# Altium project 175-00017 rev 1, Two Axis Stepper Driver.PrjPCB
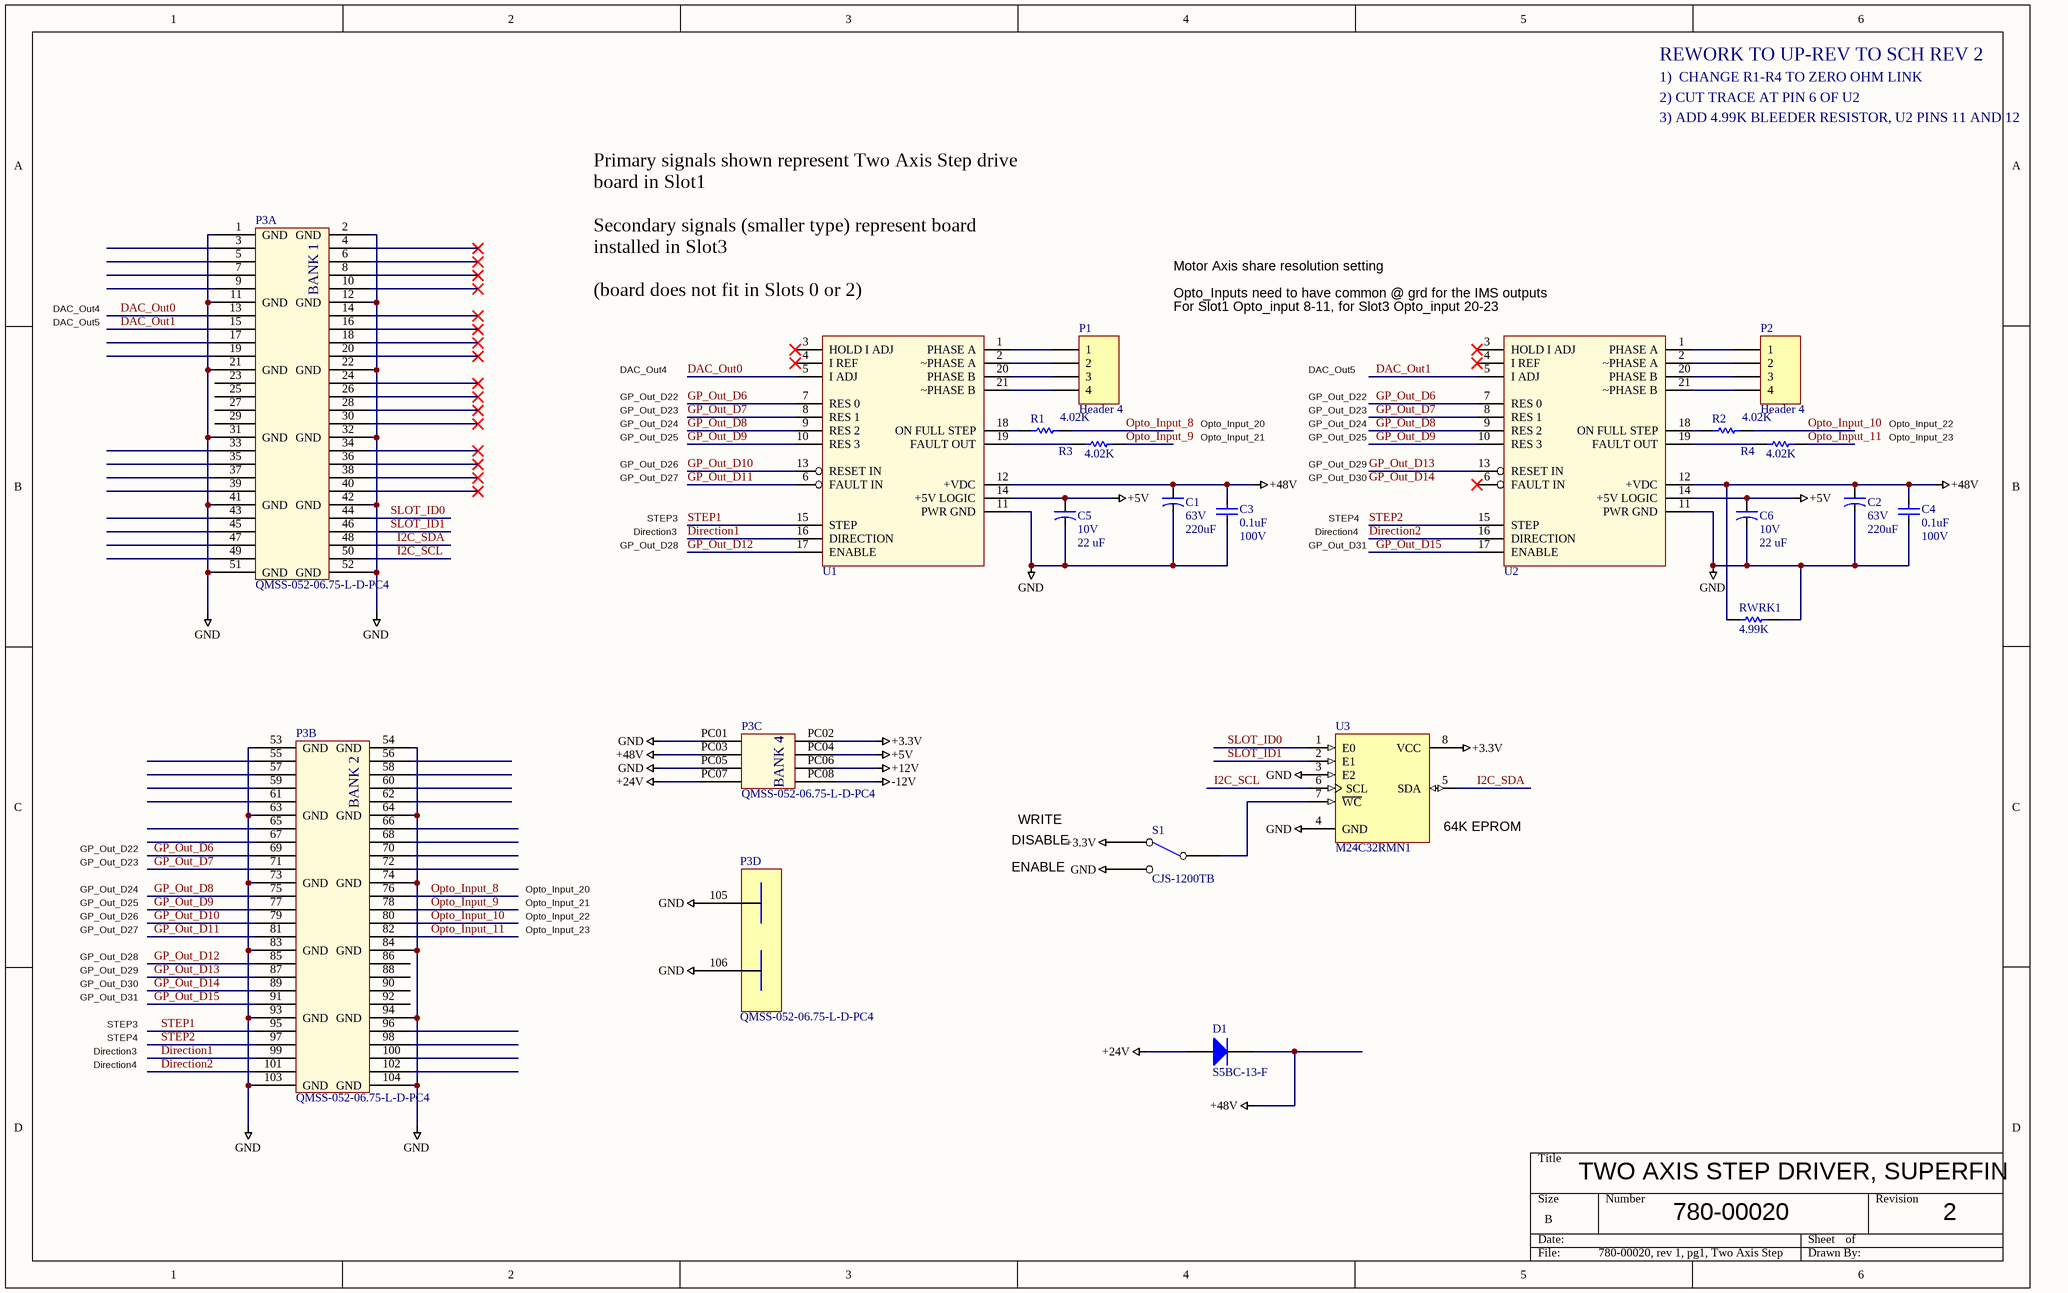
[diagram p0: 780-00020, rev 1, pg1, Two Axis Stepper Driver.SchDoc]
1 sheet, 19 parts. Net scope: global (net labels, ports and power ports of the same name join across sheets).
Board file: 175-00017_rev1, Two Axis Stepper Driver Apps Board.PcbDoc

## Sheet 780-00020, rev 1, pg1, Two Axis Stepper Driver.SchDoc
size B; PageSetup: Record=PageOptions|CenterHorizontal=True|CenterVertical=True|PrintScale=1.09|XCorrection=1.00|YCorrection=1.00|PrintKind=0|BorderSize=5000000|LeftOffset=0|BottomOffset=0|Orientation=2|PaperLength=1000|PaperWidth=1000|Scale=100|PaperSource=7|PrintQuality=-4|MediaType=1|DitherType=10|PaperKind=Tabloid 11 x 17in|PrintScaleMode=1

### Parts
C1  63V  value 220uF  [CAP 220uF 63V]
C2  63V  value 220uF  [CAP 220uF 63V]
C3  100V  value 0.1uF  [SMD_0805]
C4  100V  value 0.1uF  [SMD_0805]
C5  10V  value 22 uF  [SMD_CAP_3216]
C6  10V  value 22 uF  [SMD_CAP_3216]
D1  S5BC-13-F  [SMC]
P1  Header 4  [HDR1X4 for IDC]
P2  Header 4  [HDR1X4 for IDC]
P3  QMSS-052-06.75-L-D-PC4  [QMS SMD PWR PINS - 104PIN]  (parts A,B,C,D of 4)
R1  value 4.02K  [SMD_0805]  (hidden comment: Res 0805)
R2  value 4.02K  [SMD_0805]  (hidden comment: Res 0805)
R3  value 4.02K  [SMD_0805]  (hidden comment: Res 0805)
R4  value 4.02K  [SMD_0805]  (hidden comment: Res 0805)
RWRK1  value 4.99K  [AXIAL-0.4]  (hidden comment: Res TH)
S1  CJS-1200TB  [CAS-120B]
U1  IM481H Plus  [IM481H Vertical]  (value not drawn)
U2  IM481H Plus  [IM481H Vertical]  (value not drawn)
U3  M24C32RMN1  [SOP8_N]

### Nets
+3.3V: P3.PC02 S1.3(NC) U3.8(VCC)
+5V: C5.1 C6.1 P3.PC04 U1.14(+5V_LOGIC) U2.14(+5V_LOGIC)
+12V: P3.PC06
+24V: D1.1(A) P3.PC07
+48V: C1.1 C2.1 C3.2 C4.2 D1.2(K) P3.PC03 RWRK1.1 U1.12(+VDC) U2.12(+VDC)
-12V: P3.PC08
GND: C1.2 C2.2 C3.1 C4.1 C5.2 C6.2 P3.1(GND) P3.2(GND) P3.11(GND) P3.12(GND) P3.21(GND) P3.22(GND) P3.31(GND) P3.32(GND) P3.41(GND) P3.42(GND) P3.51(GND) P3.52(GND) P3.53(GND) P3.54(GND) P3.63(GND) P3.64(GND) P3.73(GND) P3.74(GND) P3.83(GND) P3.84(GND) P3.93(GND) P3.94(GND) P3.103(GND) P3.104(GND) P3.105(GND) P3.106(GND) P3.PC01 P3.PC05 RWRK1.2 S1.1(NO) U1.11(PWR_GND) U2.11(PWR_GND) U3.3(E2) U3.4(GND)
DAC_Out0: P3.13 U1.5(I_ADJ)
DAC_Out1: P3.15 U2.5(I_ADJ)
Direction1: P3.99 U1.16(DIRECTION)
Direction2: P3.101 U2.16(DIRECTION)
GP_Out_D6: P3.69 U1.7(RES_0) U2.7(RES_0)
GP_Out_D7: P3.71 U1.8(RES_1) U2.8(RES_1)
GP_Out_D8: P3.75 U1.9(RES_2) U2.9(RES_2)
GP_Out_D9: P3.77 U1.10(RES_3) U2.10(RES_3)
GP_Out_D10: P3.79 U1.13(RESET_IN)
GP_Out_D11: P3.81 U1.6(FAULT_IN)
GP_Out_D12: P3.85 U1.17(ENABLE)
GP_Out_D13: P3.87 U2.13(RESET_IN)
GP_Out_D14: P3.89
GP_Out_D15: P3.91 U2.17(ENABLE)
I2C_SCL: P3.50 U3.6(SCL)
I2C_SDA: P3.48 U3.5(SDA)
Opto_Input_8: P3.76 R1.2
Opto_Input_9: P3.78 R3.2
Opto_Input_10: P3.80 R2.2
Opto_Input_11: P3.82 R4.2
SLOT_ID0: P3.44 U3.1(E0)
SLOT_ID1: P3.46 U3.2(E1)
STEP1: P3.95 U1.15(STEP)
STEP2: P3.97 U2.15(STEP)
NetP1_1: P1.1 U1.1(PHASE_A)
NetP1_2: P1.2 U1.2(~PHASE_A)
NetP1_3: P1.3 U1.20(PHASE_B)
NetP1_4: P1.4 U1.21(~PHASE_B)
NetP2_1: P2.1 U2.1(PHASE_A)
NetP2_2: P2.2 U2.2(~PHASE_A)
NetP2_3: P2.3 U2.20(PHASE_B)
NetP2_4: P2.4 U2.21(~PHASE_B)
NetR1_1: R1.1 U1.18(ON_FULL_STEP)
NetR2_1: R2.1 U2.18(ON_FULL_STEP)
NetR3_1: R3.1 U1.19(FAULT_OUT)
NetR4_1: R4.1 U2.19(FAULT_OUT)
NetS1_2: S1.2(COM) U3.7(~{WC})

Not connected (* = marked no-connect by the designer): P3 3 4* 5 6* 7 8* 9 10* 14* 16* 17 18* 19 20* 23 24* 25 26* 27 28* 29 30* 33 34* 35 36* 37 38* 39 40* 43 45 47 49 55 56 57 58 59 60 61 62 65 66 67 68 70 72 86 88 90 92 96 98 100 102; U1 3(HOLD_I_ADJ)* 4(I_REF)*; U2 3(HOLD_I_ADJ)* 4(I_REF)* 6(FAULT_IN)*

### Notes on the sheet
- REWORK TO UP-REV TO SCH REV 2
- 1)  CHANGE R1-R4 TO ZERO OHM LINK
- 2) CUT TRACE AT PIN 6 OF U2
- 3) ADD 4.99K BLEEDER RESISTOR, U2 PINS 11 AND 12
- Motor Axis share resolution setting
- (near U2) Opto_Inputs need to have common @ grd for the IMS outputs
- DAC_Out4
- DAC_Out5
- Primary signals shown represent Two Axis Step drive board in Slot1
  Secondary signals (smaller type) represent board installed in Slot3
  (board does not fit in Slots 0 or 2)
- (near U2) For Slot1 Opto_input 8-11, for Slot3 Opto_input 20-23
- GP_Out_D22
- GP_Out_D23
- GP_Out_D24
- Opto_Input_20
- Opto_Input_22
- GP_Out_D25
- GP_Out_D26
- GP_Out_D27
- Opto_Input_21
- GP_Out_D29
- GP_Out_D30
- Opto_Input_23
- GP_Out_D28
- Direction3
- STEP3
- GP_Out_D31
- Direction4
- STEP4
- WRITE
- (near U3) 64K EPROM
- DISABLE
- ENABLE
- TWO AXIS STEP DRIVER, SUPERFIN
- 780-00020
- 2
- Labels drawn without touching a wire or pin: GP_Out_D14
- (in symbol QMSS-PC4-104 pin, part A) BANK 1
- (in symbol QMSS-PC4-104 pin, part B) BANK 2
- (in symbol QMSS-PC4-104 pin, part C) BANK 4

### Library data of the parts
C1 C2 = Cap 220uF, 63V: CAP 220UF 63V ELECT MVH SMD; Manufacturer: United Chemi-Con; Manuf p/n: EMVH630ARA221MKG5S; Vendor: DigiKey; Vendor p/n: 565-2337-1-ND; Vendor Mult.: 5; LCO p/n: 120-00041; COST: 2.10
C3 C4 = Cap SMD: Capacitor; Manufacturer: TDK; Manuf p/n: C2012X7R2A104K; Vendor: Digi-Key; Vendor p/n: 445-1418-1-ND; Vendor Mult.: 10; LCO p/n: 120-00044; COST: 0.165
C5 C6 = Cap Tant 16V: outline 3.2mm x 1.6mm; Manufacturer: AVX; Manuf p/n: TAJA226K010RNJ; Vendor: DIGIKEY; Vendor p/n: 478-1663-1-ND; Vendor Mult.: 1; LCO p/n: 120-00045; COST: 0.78
D1 = Diode: Default Diode; Manufacturer: Diodes Inc; Value: 5A / 100V; Vendor: DigiKey; Vendor Mult.: 1; Vendor p/n: S5BC-FDICT-ND; Description: RECTIFIER GPP SMD 100V 5A SMC; LCO p/n: 140-00012; COST: 0.47; Manuf p/n: S5BC-13-F; Arena Type: Diode
P1 P2 = Header 4: Header, 4-Pin; LCO p/n: 125-00037; VALUE: Header 4
P3 = QMSS-PC4-104 pin: SAMTEC QMSS W/PWR PINS; Vendor Mult.: 1; LCO p/n: 125-00056; Manufacturer: SAMTEC; Manuf p/n: QMSS-052-06.75-L-D-PC4; Vendor: SAMTEC; Vendor p/n: QMSS-052-06.75-L-D-PC4; COST: 18.33; VALUE: QMSS-052-06.75-L-D-PC4
R1-R4 = Res SMD: Resistor 0805; Manufacturer: Vishay/Dale; Manuf p/n: CRCW08054.02KFKEA; Vendor: DIGIKEY; Vendor p/n: 541-4.02KCCT-ND; Vendor Mult.: 10; LCO p/n: 181-04022; COST: 0.09
RWRK1 = Res TH: Resistor
S1 = SW_SPDT_DOUG: Manufacturer: Copal Electronics; Manuf p/n: CAS-120TB; Vendor: DIGIKEY; Vendor Mult.: 1; Vendor p/n: CAS120JTR-ND; LCO p/n: 185-00010; COST: 1.27; Value: SW_SPDT
U1 U2 = IM481H Plus: Hybrid stepper motor driver; LCO p/n: 170-00001; VALUE: IM481H
U3 = M24C32RMN1: 32 Kbit Serial I²C Bus EEPROM; LCO p/n: 150-00076